# EAGLE design MC_2015 (EAGLE 6.4)
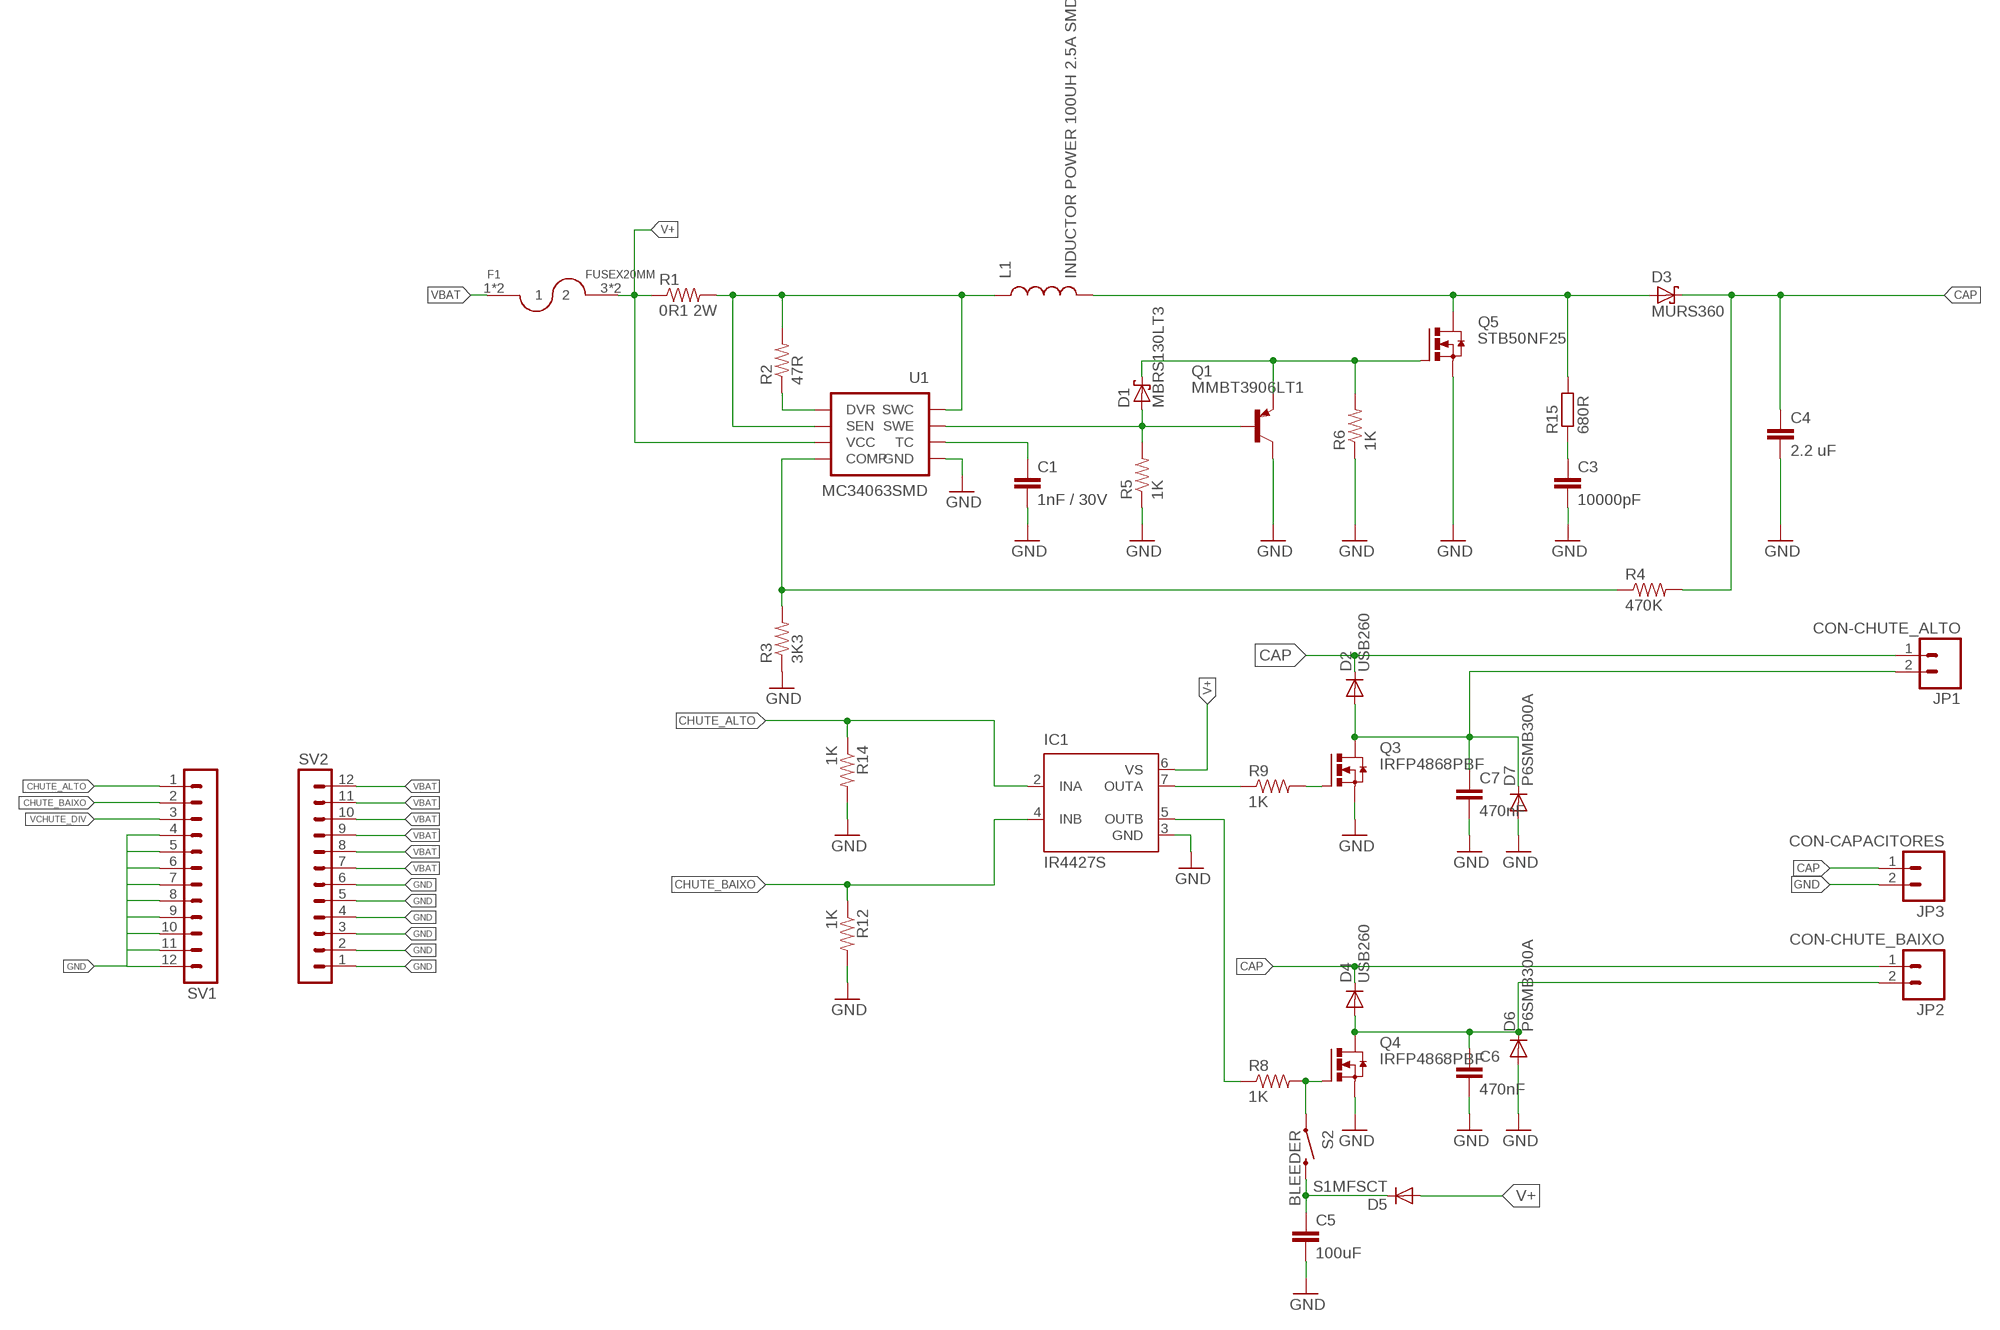
[diagram p0: schematic, sheet 1]

## Parts
C1  1nF / 30V  CAP0805  [0805]
C3  10000pF  CAP1210  [1210]
C4  2.2 uF  C-EUC2220K  [C2220K]
C5  100uF  C-EUC1210  [C1210]
C6  470nF  C-EUC1812  [C1812]
C7  470nF  C-EUC1812  [C1812]
D1  MBRS130LT3  [SMB]
D2  USB260  DIODE-SMB  [SMB]
D3  MURS360  SCHOTTKY-DIODESMC  [SMC]
D4  USB260  DIODE-SMB  [SMB]
D5  S1MFSCT  DIODESMA  [SMA-DIODE]
D6  P6SMB300A  DIODE-SMB  [SMB]
D7  P6SMB300A  DIODE-SMB  [SMB]
F1  FUSEX20MM  [FUSE_5MM]
IC1  IR4427S  [SO08]
JP1  CON-CHUTE_ALTO  M025MM  [SCREWTERMINAL-5MM-2]
JP2  CON-CHUTE_BAIXO  M025MM  [SCREWTERMINAL-5MM-2]
JP3  CON-CAPACITORES  M025MM  [SCREWTERMINAL-5MM-2]
L1  INDUCTOR POWER 100UH 2.5A SMD  INDUCTORPWR  [CDRH125]
Q1  MMBT3906LT1  MMBT3906LT1SMD  [SOT23-BEC]
Q3  IRFP4868PBF  IRFP240  [TO247BV]
Q4  IRFP4868PBF  IRFP240  [TO247BV]
Q5  STB50NF25  IRF3704S  [D2PACK]
R1  0R1 2W  RESISTOR2512  [R2512]
R2  47R  RESISTOR  [0805]
R3  3K3  RESISTOR  [0805]
R4  470K  RESISTOR2512  [R2512]
R5  1K  RESISTOR  [0805]
R6  1K  RESISTOR  [0805]
R8  1K  RESISTOR  [0805]
R9  1K  RESISTOR0805-RES  [0805]
R12  1K  RESISTOR  [0805]
R14  1K  RESISTOR  [0805]
R15  680R  R-EU_R1210  [R1210]
S2  BLEEDER  SWITCH-MOMENTARY-2PTH  [TACTILE-PTH]
SV1  MA12-1  [MA12-1]
SV2  MA12-1  [MA12-1]
U1  MC34063SMD  [SO08]

## Nets
C3: C3.1 R15.1
CAP [200V]: C4.1 D2.C D3.C D4.C JP1.1 JP2.1 JP3.1 R4.2
CHUTE_ALTO: IC1.2(INA) R14.1 SV1.1
CHUTE_BAIXO: IC1.4(INB) R12.1 SV1.2
GND [200V]: C1.2 C3.2 C4.2 C5.2 C6.2 C7.2 D6.A D7.A IC1.3(GND) JP3.2 Q1.C Q3.S Q4.S Q5.3(S) R3.1 R5.1 R6.1 R12.2 R14.2 SV1.4 SV1.5 SV1.6 SV1.7 SV1.8 SV1.9 SV1.10 SV1.11 SV1.12 SV2.1 SV2.2 SV2.3 SV2.4 SV2.5 SV2.6 U1.4(GND)
N$1: IC1.5(OUTB) R8.1
N$2 [200V]: L1.1 R1.2 R2.2 U1.1(SWC) U1.7(SEN)
N$3: R2.1 U1.8(DVR)
N$4: C1.1 U1.3(TC)
N$5: R3.2 R4.1 U1.5(COMP)
N$6: Q4.G R8.2 S2.1
N$7 [200V]: D3.A L1.2 Q5.2(D) R15.2
N$8: D1.A Q1.B R5.2 U1.2(SWE)
N$9: C5.1 D5.C S2.3
N$10: D1.C Q1.E Q5.1(G) R6.2
N$11: IC1.7(OUTA) R9.1
N$12: Q3.G R9.2
N$13 [200V]: C7.1 D2.A D7.C JP1.2 Q3.D
N$15 [200V]: C6.1 D4.A D6.C JP2.2 Q4.D
V+ [200V]: D5.A F1.3 F1.4 IC1.6(VS) R1.1 U1.6(VCC)
VBAT [200V]: F1.1 F1.2 SV2.7 SV2.8 SV2.9 SV2.10 SV2.11 SV2.12
VCHUTE_DIV: SV1.3

## Library data of the parts
C1 = SparkFun:CAP: Capacitor Standard 0603 ceramic capacitor, and 0.1" leaded capacitor.
C3 = SparkFun-Passives:CAP: Capacitor Standard 0603 ceramic capacitor, and 0.1" leaded capacitor.
C4 C5 = resistor:C-EU: CAPACITOR, European symbol
C6 C7 = rcl:C-EU: CAPACITOR, European symbol
D1 = diode:MBRS130LT3: Schottky Power Rectifier Source: http://www.onsemi.com/pub/Collateral/MBRS130LT3-D.PDF
D2 D4 D6 D7 = diode:DIODE-: DIODE
D3 = diode:SCHOTTKY-DIODE: Schottky Diode
D5 = SparkFun-DiscreteSemi:DIODE: Diode These are standard reverse protection diodes and small signal diodes. SMA package can handle up to about 1A. SOD-323 can handle about 200mA. What the SOD-323 package when ordering, there are some mfgs out there that are 5-pin packages.
F1 = SparkFun-Passives:FUSE
IC1 = ir:IR4427: DUAL LOW SIDE DRIVER Source: ID4426.pdf
JP1-JP3 = SparkFun-Connectors:M02: Header 2 Standard 2-pin 0.1" header. Use with straight break away headers (SKU : PRT-00116), right angle break away headers (PRT-00553), swiss pins (PRT-00743), machine pins (PRT-00117), and female headers (PRT-00115). Molex polarized connector foot print use with SKU : PRT-08233 with associated crimp pins and housings.
L1 = SparkFun:INDUCTOR: Inductors Basic Inductor/Choke - 0603 and 1206. Footprints are not proven and vary greatly between part numbers.
Q1 = transistor-pnp:MMBT3906*: PNP Transistror
Q3 Q4 = transistor-power:IRFP240: HEXFET Power MosFet Source: http://www.irf.com/
Q5 = transistor-power:IRF3704: SMPS MOSFET HEXFET® Power MOSFET Source: http://www.irf.com/product-info/datasheets/data/irf3704.pdf
R1-R3 R5 R6 R8 R12 R14 = SparkFun:RESISTOR: Resistor
R4 R9 = SparkFun-Passives:RESISTOR: Resistor
R15 = resistor:R-EU_: RESISTOR, European symbol
S2 = SparkFun:SWITCH-MOMENTARY-2
SV1 SV2 = con-lstb:MA12-1: PIN HEADER; OC_FARNELL: unknown; OC_NEWARK: unknown
U1 = SparkFun:MC34063

## Net classes
0 default: width 0.254 mm, drill 0.254 mm, clearance 0.254 mm
1 200V: width 0.254 mm, drill 0.254 mm, clearance 0.254 mm

## Board
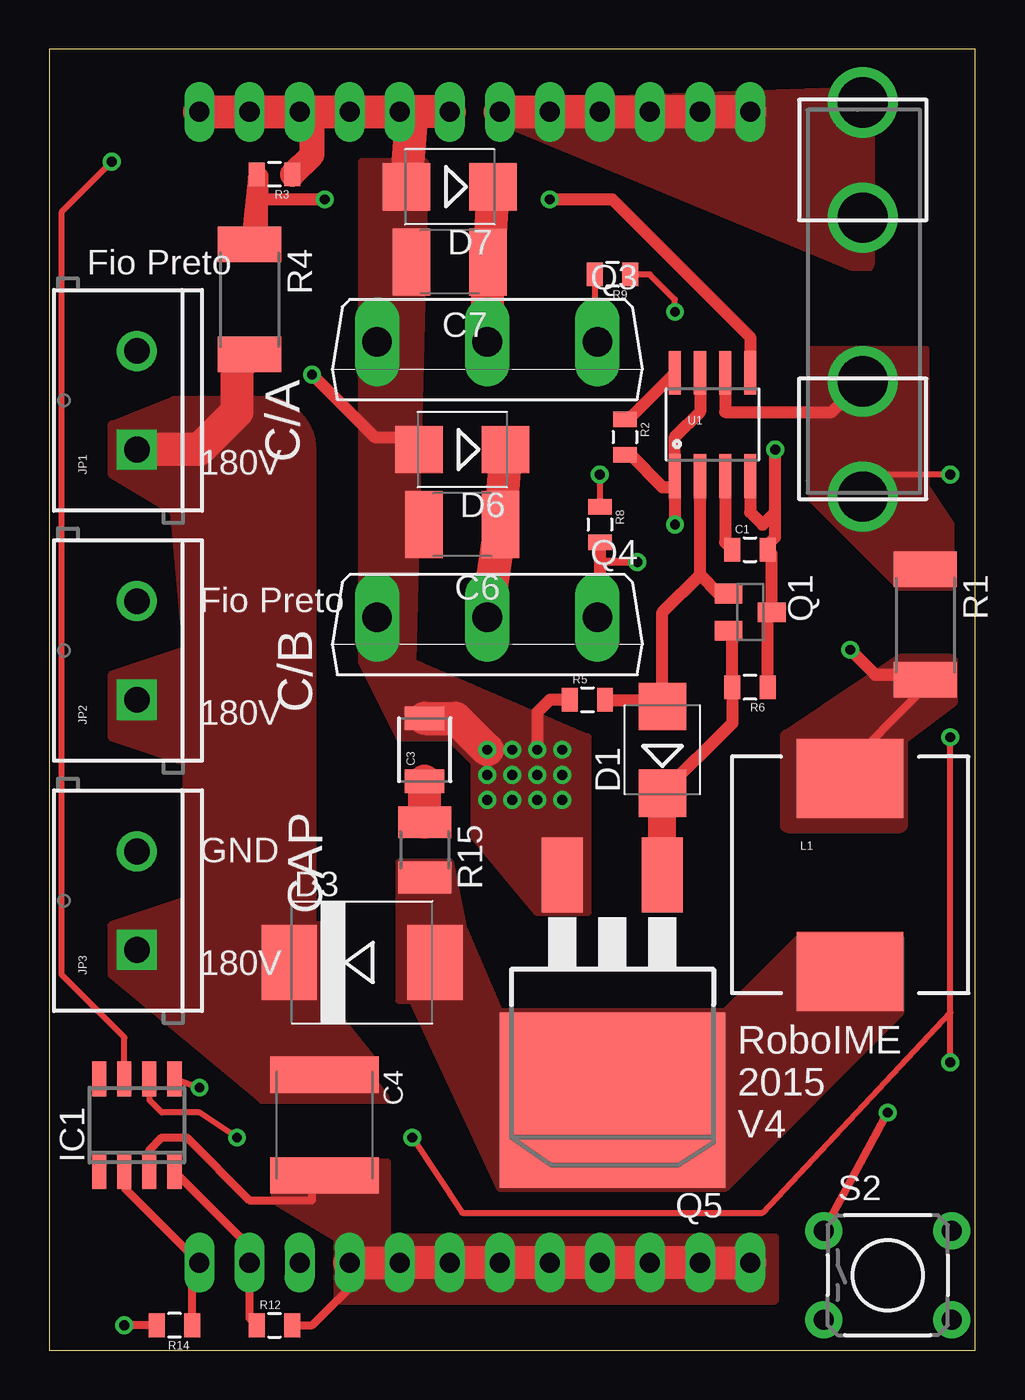
[diagram p1: board, top side]
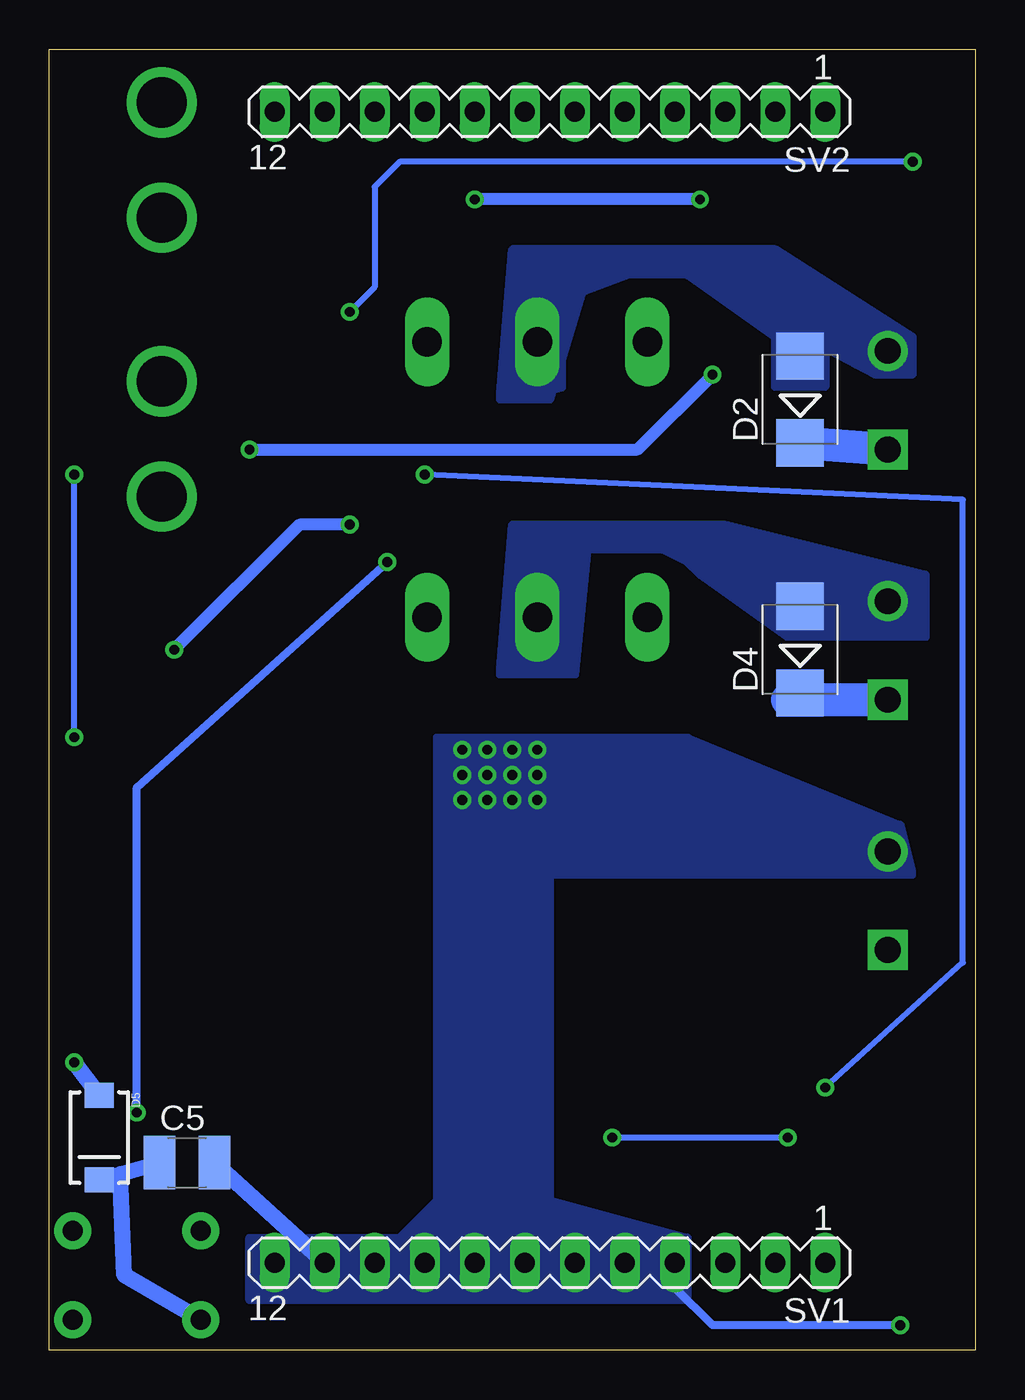
[diagram p2: board, bottom side, seen from below]

Size 46.99 x 66.04 mm. Coordinates in mm from the lower left corner, seen from the top.
Outline: 0,0 46.99,0 46.99,66.04 0,66.04 0,0
Copper layers (1*16): Top 0.035mm / dielectric 1.5mm / Bottom 0.035mm
Design rules "default *": minimum track width 10mil, minimum drill 10mil, track to track 8mil, track to pad 8mil, pad to pad 8mil, via to via 8mil, smd to smd 8mil, copper to edge 5mil, drill to drill 8mil, minimum pad ring 10mil, minimum via ring 8mil, stop-mask expansion 4mil, vias tented up to drill 0mil, thermal gap 10mil

### Footprints (pad centres in the part's own frame; a part is rotated, then mirrored left to right if it is on the bottom)
0805 = smd 0.8 x 1.2: 1 -0.9,0; 2 0.9,0
1210 = smd 1.2 x 2: 1 -1.6,0; 2 1.6,0
C2220K = smd 1.85 x 5.5: 1 -2.55,0; 2 2.55,0
C1210 = smd 1.6 x 2.7: 1 -1.4,0; 2 1.4,0
C1812 = smd 1.9 x 3.4: 1 -1.95,0; 2 1.95,0
SMB = smd 2.4 x 2.4: A 2.2,0; C -2.2,0
SMC = smd 2.8 x 3.8: A 3.7,0; C -3.7,0
SMA-DIODE = smd 1.27 x 1.47: A -2.15,0; C 2.15,0
FUSE_5MM = drill 2.54 pad 3.556: 1 0,-10; 2 0,-4.158; 3 0,4.158; 4 0,10
SO08 = smd 0.72 x 1.78: 1 -1.905,-2.35; 2 -0.635,-2.35; 3 0.635,-2.35; 4 1.905,-2.35; 5 1.905,2.35; 6 0.635,2.35; 7 -0.635,2.35; 8 -1.905,2.35
SCREWTERMINAL-5MM-2 = drill 1.3 pad 2.032 square: 1 0,0 | drill 1.3 pad 2.032: 2 5,0
CDRH125 = smd 5.4 x 4: 1 0,4.9; 2 0,-4.9
SOT23-BEC = smd 1 x 1.4: B -0.95,-1.1; C 0,1.1; E 0.95,-1.1
TO247BV = drill 1.499 long: D 0,-2.921; G -5.588,-2.921; S 5.588,-2.921
D2PACK = smd 2.083 x 3.81: 1 -2.54,-8.89; 3 2.54,-8.89 | smd 11.43 x 8.89: 2 0,2.54
R2512 = smd 1.8 x 3.2: 1 -2.8,0; 2 2.8,0
R1210 = smd 1.6 x 2.7: 1 -1.4,0; 2 1.4,0
TACTILE-PTH = drill 1.016 pad 1.88: 1 -3.251,2.261; 2 3.251,2.261; 3 -3.251,-2.261; 4 3.251,-2.261
MA12-1 = drill 1.016 long: 1 -13.97,0; 2 -11.43,0; 3 -8.89,0; 4 -6.35,0; 5 -3.81,0; 6 -1.27,0; 7 1.27,0; 8 3.81,0; 9 6.35,0; 10 8.89,0; 11 11.43,0; 12 13.97,0
SO08' = smd 0.61 x 2.21: 1 -1.905,-2.616; 2 -0.635,-2.616; 3 0.635,-2.616; 4 1.905,-2.616; 5 1.905,2.616; 6 0.635,2.616; 7 -0.635,2.616; 8 -1.905,2.616

### Placement (x,y rotation side)
C1  35.56,40.64 0 top
C3  19.05,30.48 90 top
C4  13.97,11.43 270 top
C5  40.01,9.53 0 bottom
C6  20.95,41.91 180 top
C7  20.32,55.25 180 top
D1  31.11,30.48 90 top
D2  8.89,48.26 90 bottom
D3  15.88,19.68 0 top
D4  8.89,35.56 90 bottom
D5  44.45,10.79 270 bottom
D6  20.95,45.72 180 top
D7  20.32,59.05 180 top
F1  41.28,53.34 180 top
IC1  4.45,11.43 0 top
JP1  4.45,45.72 90 top
JP2  4.45,33.02 90 top
JP3  4.45,20.32 90 top
L1  40.64,24.13 0 top
Q1  35.56,37.47 270 top
Q3  22.22,48.26 180 top
Q4  22.22,34.29 180 top
Q5  28.57,15.24 180 top
R1  44.45,36.83 270 top
R2  29.21,46.36 270 top
R3  11.43,59.69 180 top
R4  10.16,53.34 270 top
R5  27.3,33.02 0 top
R6  35.56,33.66 180 top
R8  27.94,41.91 270 top
R9  28.57,54.61 180 top
R12  11.43,1.27 0 top
R14  6.35,1.27 180 top
R15  19.05,25.4 270 top
S2  42.55,3.81 0 top
SV1  21.59,4.45 180 bottom
SV2  21.59,62.87 180 bottom
U1  MC34063SMD  [SO08']  33.66,46.99 0 top

### Tracks (layer width: path | path; a pad name or v marks a point on that pad's centre or on a via)
C3
  Top 1.676: R15.1 C3.1
CAP
  Top 1.676: R4.2 9.53,49.91 9.53,47.62 7.62,45.72 JP1.1
  Bottom 1.676: JP1.1 D2.C | JP2.1 9.53,33.02 D4.C
  pour Top (no thermals): 11.43,14.61 10.79,17.78 10.79,21.59 13.97,21.59 13.97,17.78 16.51,14.61 16.51,13.34 11.43,13.34
  pour Top (no thermals): 17.14,12.7 10.79,12.7 3.17,19.05 3.17,21.59 6.98,22.86 6.98,29.84 3.17,31.11 3.17,34.29 6.98,35.56 6.35,42.55 3.17,44.45 3.17,46.99 6.35,48.26 10.79,48.26 arc-90 13.33,45.72 13.33,17.78
CHUTE_ALTO
  Top 0.406: R14.1 7.25,4.08 SV1.1 3.81,8.26 IC1.2
CHUTE_BAIXO
  Top 0.406: R12.1 10.16,1.64 SV1.2 10.16,5.27 IC1.4
GND  (via drill 0.5)
  Top 0.406: R12.2 13.33,1.27 15.24,3.17 SV1.4 | R14.2 v3.81,1.27 | IC1.3 5.08,10.16 5.71,10.79 6.98,10.79 10.16,7.62 13.33,7.62 13.33,8.25 C4.2
  Top 0.61: U1.4 35.56,42.55 36.2,41.91 36.83,42.55 | 36.83,42.55 v36.83,45.72 | v13.33,49.53 16.51,46.36 18.12,46.36 D6.A | 36.83,42.55 36.83,41.27 36.46,40.91 C1.2 36.66,40.44 Q1.C 36.46,37.27 R6.1 | R5.1 25.4,33.02 24.77,32.39 v24.77,30.48
  Top 1.016: 27.86,4.52 SV1.9
  Top 1.27: R3.1 13.33,60.7 13.33,62.87
  Top 1.676: SV2.6 18.41,62.87 | 18.41,62.87 SV2.5 SV2.4 13.33,62.87 SV2.3 SV2.2 SV2.1 | SV1.4 SV1.5 SV1.6 SV1.7 SV1.8 SV1.9 SV1.10 SV1.11 SV1.12 | C3.2 20.62,32.08 v22.22,30.48 | D7.A 18.41,62.87
  Bottom 0.406: v3.81,1.27 13.33,1.27 15.24,3.17 SV1.4
  Bottom 0.61: v36.83,45.72 17.14,45.72 v13.33,49.53
  Bottom 0.813: C5.2 SV1.11
  other vias: 23.5,30.48 22.22,29.21 22.22,27.94 23.5,27.94 23.5,29.21 24.77,29.21 24.77,27.94 26.04,27.94 26.04,29.21 26.04,30.48
  pour Top (no thermals): 11.43,7.62 14.61,5.71 14.61,2.54 36.83,2.54 36.83,5.71 17.14,5.71 17.14,9.53 11.43,9.53
  pour Top (no thermals): 24.77,22.22 21.59,26.04 21.59,31.11 27.3,31.11 27.3,22.22
  pour Bottom (no thermals): 21.59,31.11 21.59,7.62 14.61,5.71 14.61,2.54 36.83,2.54 36.83,5.71 29.21,5.71 27.3,7.62 27.3,31.11
  pour Top (no thermals): 20.32,31.11 17.78,31.11 15.88,34.93 15.88,60.33 19.05,60.33 18.41,34.93 27.3,31.11 27.3,29.21 21.59,29.21 21.59,29.84
  pour Bottom (no thermals): 3.17,24.13 27.3,24.13 27.3,31.11 14.61,31.11 3.81,26.67
N$1  (via drill 0.5)
  Top 0.305: IC1.5 v7.62,13.34 | v27.94,44.45 R8.1
  Bottom 0.305: v7.62,13.34 0.64,19.68 0.64,43.18 v27.94,44.45
N$2  (via drill 0.5)
  Top 0.406: R1.2 44.45,33.66 40.01,29.21
  Top 0.61: U1.7 33.02,47.62 31.75,46.36 U1.1 31.75,43.82 | 31.75,43.82 v31.75,41.91 | v40.64,35.56 41.91,34.29 44.19,34.29 R1.2 | R2.2 29.47,45.46 31.11,43.82 31.75,43.82
  Bottom 0.61: v31.75,41.91 34.29,41.91 v40.64,35.56
  pour Top (no thermals): 43.18,34.93 37.47,31.11 37.47,26.67 42.55,26.67 43.18,26.67 43.18,31.11 45.72,33.02 45.72,34.93
N$3
  Top 0.61: R2.1 29.4,47.26 U1.8
N$4
  Top 0.61: U1.3 34.29,41.01 C1.1
N$5  (via drill 0.5)
  Top 0.61: R4.1 10.79,56.77 10.79,58.42 | 10.79,59.69 10.79,58.42 | 10.79,58.42 v13.97,58.42 | v25.4,58.42 28.57,58.42 35.56,51.44 U1.5
  Top 0.813: R4.1 R3.2
  Bottom 0.61: v13.97,58.42 v25.4,58.42
N$6  (via drill 0.5)
  Top 0.406: S2.1 v42.55,12.06 | v29.84,40.01 27.94,40.01
  Top 0.61: R8.2 27.94,40.01 27.94,37.34 Q4.G
  Bottom 0.406: v42.55,12.06 42.55,28.57 v29.84,40.01
N$7
  pour Top (no thermals): 38.1,20.95 43.18,20.95 43.18,17.14
  pour Top (no thermals): 18.41,17.78 22.86,8.26 34.29,8.26 43.18,17.14 43.18,20.95 38.1,20.95 34.29,17.14 22.86,17.14 20.95,21.59 17.78,21.59 17.78,17.78
  pour Top (no thermals): 17.78,21.59 17.78,24.76 20.32,24.76 20.95,21.59 20.95,17.78 17.78,17.78
N$8
  Top 0.61: Q1.B 33.98,38.41 33.02,39.37 | 33.02,39.37 U1.2 | 33.02,39.37 31.11,37.47 D1.A 30.77,33.02 R5.2
N$9
  Bottom 0.813: D5.C 43.38,8.95 | 43.38,8.95 C5.1 | S2.3 43.18,3.81 43.38,8.95
N$10
  Top 0.61: Q1.E 34.66,36.32 R6.2 34.66,31.82 D1.C
  Top 1.422: Q5.1 D1.C
N$11  (via drill 0.5)
  Top 0.305: IC1.7 3.81,15.88 0.64,19.05 0.64,57.79 v3.17,60.33 | v31.75,52.71 31.75,53.34 30.48,54.61 R9.1
  Bottom 0.305: v3.17,60.33 29.21,60.33 30.48,59.05 30.48,53.98 v31.75,52.71
N$12
  Top 0.305: R9.2 27.68,51.32 Q3.G
N$13
  Top 1.676: D7.C C7.1 Q3.D
  pour Bottom (no thermals): 3.17,51.44 10.16,55.88 23.5,55.88 23.5,48.26 20.95,48.9 20.95,53.34 15.88,55.25 5.08,49.53 3.17,49.53
  pour Bottom (no thermals): 7.62,50.8 7.62,48.9 10.16,48.9 10.16,51.44 14.61,54.61 19.68,54.61 21.59,48.26 24.13,48.26 23.5,55.88 10.16,55.88 7.62,51.44
N$15
  Top 1.676: Q4.D 22.83,41.37 | 22.83,41.37 C6.1 | D6.C 22.83,41.37
  pour Bottom (no thermals): 2.54,39.37 2.54,36.2 9.53,36.2 13.97,39.37 14.61,40.01 15.88,40.64 19.68,40.64 20.32,34.29 24.13,34.29 23.5,41.91 12.7,41.91
V+  (via drill 0.5)
  Top 0.305: IC1.6 5.08,12.7 5.71,12.06 7.62,12.06 v9.53,10.79 | v18.41,10.79 20.95,6.99 36.2,6.99 45.72,17.14 | 45.72,17.14 v45.72,31.11 | v45.72,44.45 42.39,44.45 F1.4 | v45.72,14.61 45.72,17.14
  Top 0.61: U1.6 34.29,47.62 39.72,47.62 F1.3
  Bottom 0.305: v45.72,31.11 v45.72,44.45 | v18.41,10.79 v9.53,10.79
  Bottom 0.813: D5.A v45.72,14.61
  pour Top (no thermals): 43.18,38.73 38.74,43.18 38.74,50.8 44.45,50.8 44.45,43.82 45.72,41.91 45.72,38.73
VBAT
  Top 1.676: SV2.7 SV2.8 SV2.9 SV2.10 SV2.11 SV2.12 SV2.7
  pour Top (no thermals): 22.86,62.87 41.28,55.25 41.28,63.5

### Text on the board
_tsilk: Fio Preto | C/A | 180V | Fio Preto | C/B | 180V | CAP | GND | 180V | RoboIME / 2015 / V4